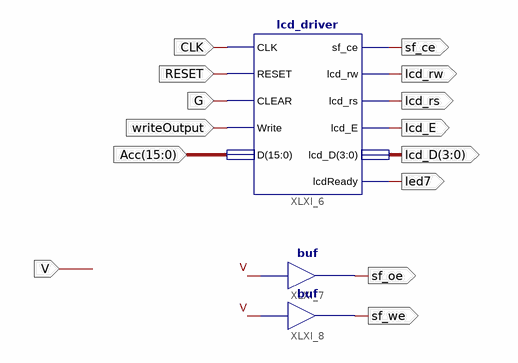
[diagram p0: schematic sheet 1]
// Xilinx ISE schematic AccToLCD.sch (spartan3e) as structural Verilog: 3 symbols, 14 ports
module AccToLCD (
  input  [15:0] Acc,
  input  CLK,
  input  writeOutput,
  input  RESET,
  input  G,
  input  V,
  output lcd_rw,
  output sf_ce,
  output lcd_rs,
  output lcd_E,
  output [3:0] lcd_D,
  output led7,
  output sf_oe,
  output sf_we
);

  lcd_driver XLXI_6 (
    .CLK(CLK), .RESET(RESET), .CLEAR(G), .Write(writeOutput), .D(Acc), .sf_ce(sf_ce), .lcd_rw(lcd_rw),
    .lcd_rs(lcd_rs), .lcd_D(lcd_D), .lcd_E(lcd_E), .lcdReady(led7));
  buf XLXI_7 (sf_oe, V);
  buf XLXI_8 (sf_we, V);
endmodule
